# Altium schematic sheet dmpro16-pcb-v1-CameraBoard.SchDoc
size A4; Organization: Altium Limited; Address1: L3, 12a Rodborough Rd; Address2: Frenchs Forest; Address3: NSW; Address4: Australia 2086; DocumentNumber: 2; SheetNumber: 2; SheetTotal: 17; SheetName: CameraBoard
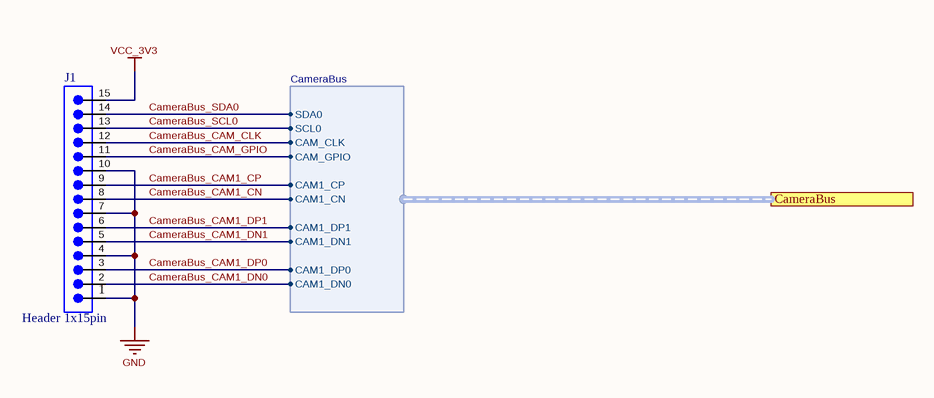
[diagram p0: dmpro16-pcb-v1-CameraBoard.SchDoc]

## Parts
J1  Header 1x15pin  [ZIF-15]

## Ports
CameraBus (harness CameraBus)

## Harnesses
CameraBus: SDA0, SCL0, CAM_CLK, CAM_GPIO, CAM1_CP, CAM1_CN, CAM1_DP1, CAM1_DN1, CAM1_DP0, CAM1_DN0

## Nets
GND: J1.1 J1.4 J1.7 J1.10
VCC_3V3: J1.15
CameraBus_CAM1_CN: J1.8 ; port CameraBus.CAM1_CN
CameraBus_CAM1_CP: J1.9 ; port CameraBus.CAM1_CP
CameraBus_CAM1_DN0: J1.2 ; port CameraBus.CAM1_DN0
CameraBus_CAM1_DN1: J1.5 ; port CameraBus.CAM1_DN1
CameraBus_CAM1_DP0: J1.3 ; port CameraBus.CAM1_DP0
CameraBus_CAM1_DP1: J1.6 ; port CameraBus.CAM1_DP1
CameraBus_CAM_CLK: J1.12 ; port CameraBus.CAM_CLK
CameraBus_CAM_GPIO: J1.11 ; port CameraBus.CAM_GPIO
CameraBus_SCL0: J1.13 ; port CameraBus.SCL0
CameraBus_SDA0: J1.14 ; port CameraBus.SDA0

## Notes on the sheet
- Board:
- Version:
- Sheetname:
- Subject:
- Group:
- Sheet
- of
- Shematic file:

## Library data of the parts
J1 = con_head_1x15pin